# Altium schematic sheet Angular_Position_Feedback.SchDoc: Angular Position Feedback
size A4
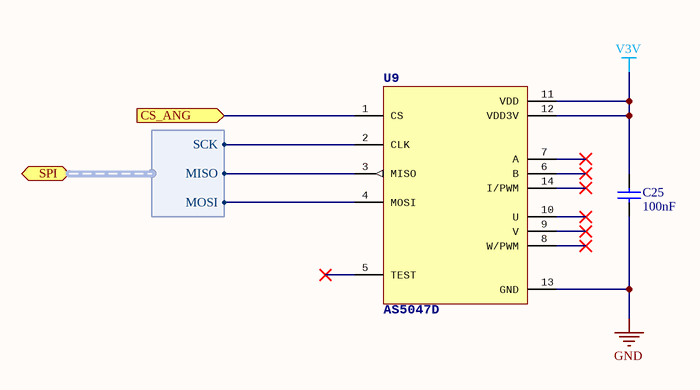
[diagram p0: Angular_Position_Feedback.SchDoc]

## Parts
C25  value 100nF  [CAPC1608X06N (0603)]  (hidden comment: Cap Semi)
U9  AS5047D  [TSSOP14]

## Ports
CS_ANG (in), SPI (harness SPI_Harness)

## Harnesses
SPI_Harness: MISO, MOSI, SCK

## Nets
GND: C25.1 U9.13(GND)
V3V: C25.2 U9.11(VDD) U9.12(VDD3V)
CS_ANG: U9.1(CS) ; port CS_ANG
NetU9_2: U9.2(CLK) ; port SPI.SCK
NetU9_3: U9.3(MISO) ; port SPI.MISO
NetU9_4: U9.4(MOSI) ; port SPI.MOSI

Not connected (* = marked no-connect by the designer): U9 5(TEST)* 6(B)* 7(A)* 8(W/PWM)* 9(V)* 10(U)* 14(I/PWM)*

## Notes on the sheet
- Title
- Size:
- Date:
- A4
- Number:
- Time:
- Revision:
- Sheet
- of
- File:

## Library data of the parts
C25 = Cap Semi: Capacitor (Semiconductor SIM Model); Published: 8-Jun-2000; LatestRevisionDate: 29-May-2009; LatestRevisionNote: IPC-7351 Footprint Added.; PackageReference: X7R; Publisher: Altium Limited; PackageDescription: Chip Capacitor